# Altium schematic sheet P0_Main_Connect.SchDoc
size A2
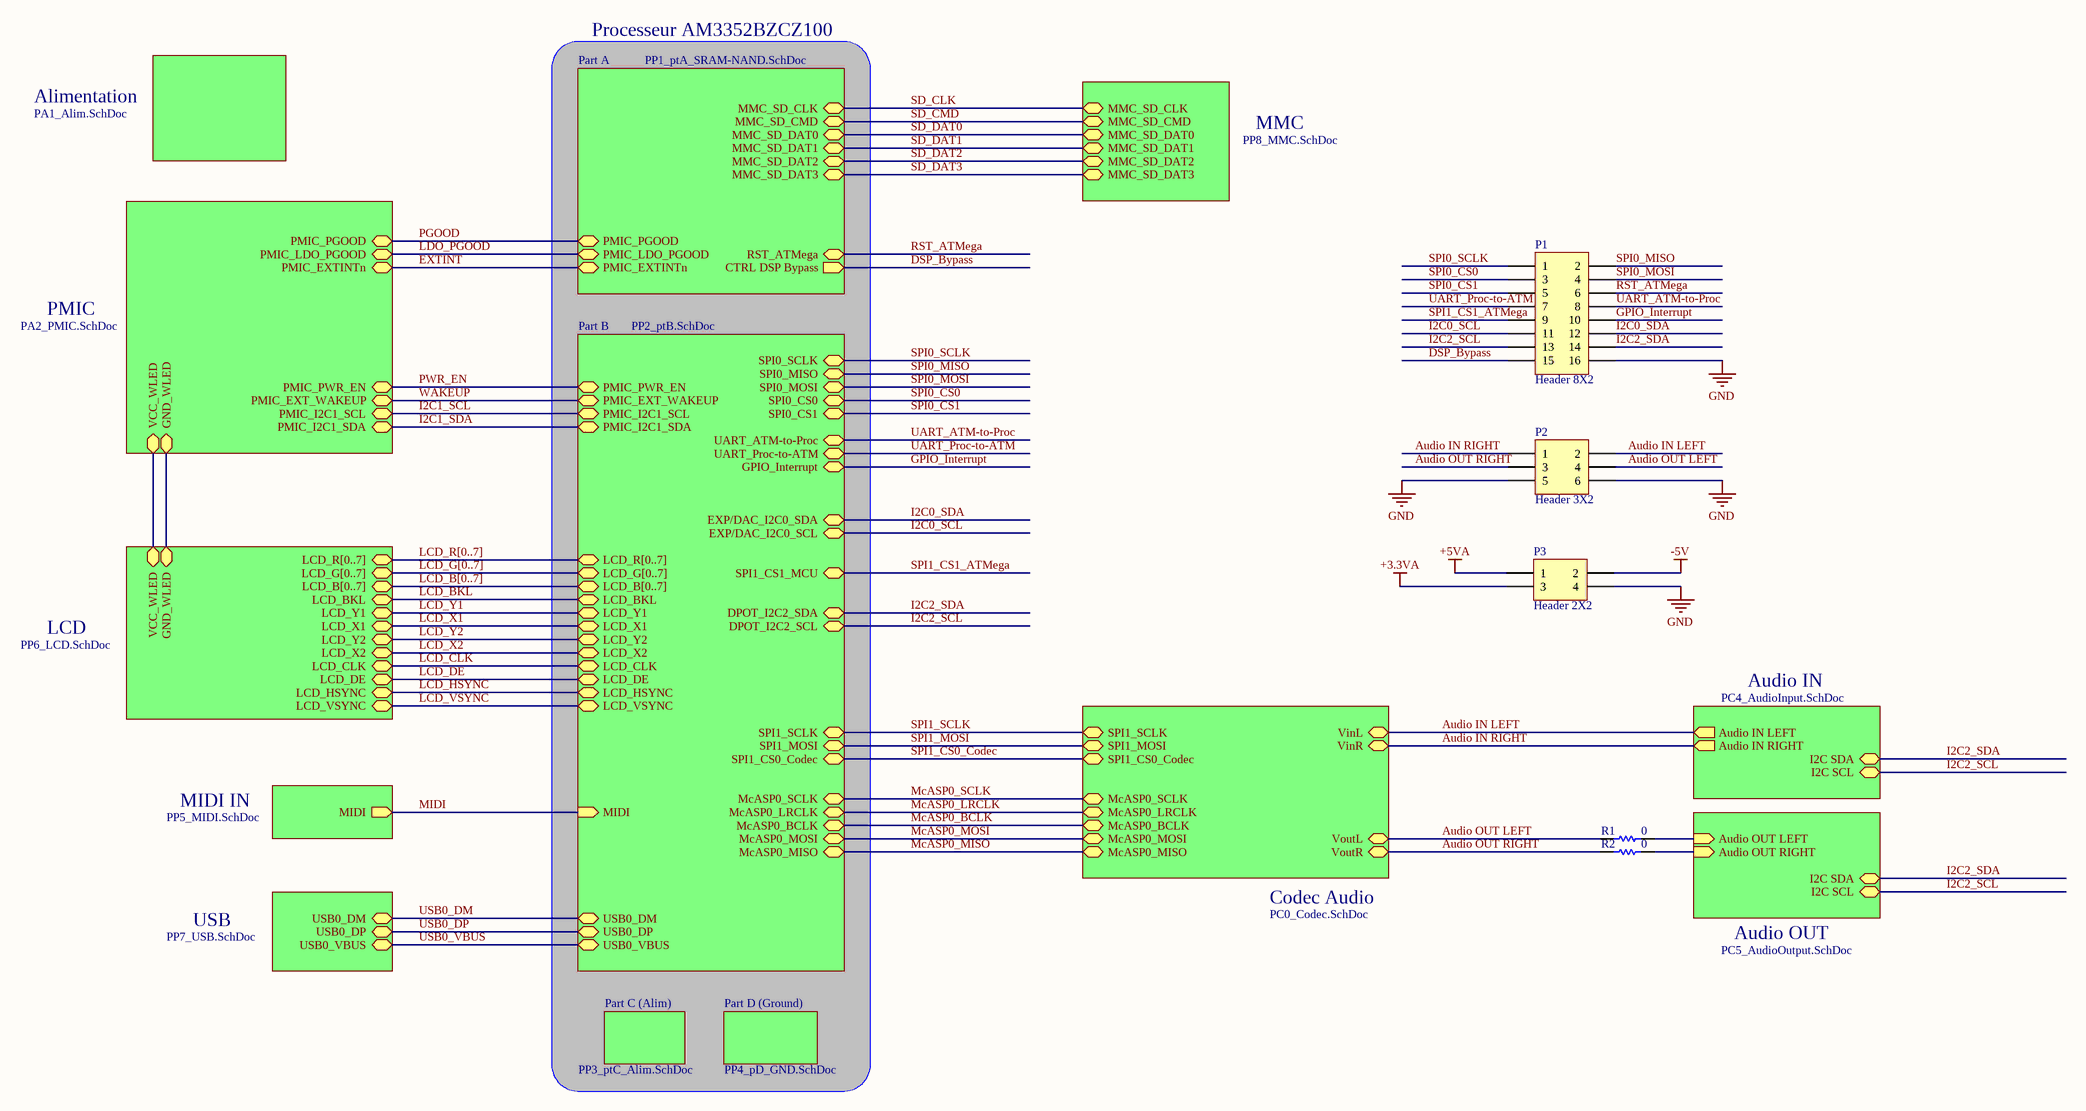
[diagram p0: P0_Main_Connect.SchDoc]

## Parts
P1  Header 8X2  [CONN_1241050-8_T]
P2  Header 3X2  [CONN_1241050-3_T]
P3  Header 2X2  [CONN_1241050-2_T]
R1  value 0  [RESC1608X05]  (hidden comment: Res 0 Ohm)
R2  value 0  [RESC1608X05]  (hidden comment: Res 0 Ohm)

## Sub-sheets
Alimentation = PA1_Alim.SchDoc: no entries
Audio IN = PC4_AudioInput.SchDoc: Audio IN RIGHT (out), Audio IN LEFT (out), I2C SCL, I2C SDA
Audio OUT = PC5_AudioOutput.SchDoc: Audio OUT RIGHT (in), Audio OUT LEFT (in), I2C SCL, I2C SDA
Codec Audio = PC0_Codec.SchDoc: SPI1_SCLK, SPI1_CS0_Codec, SPI1_MOSI, McASP0_LRCLK, McASP0_BCLK, McASP0_MOSI, McASP0_MISO, McASP0_SCLK, VoutL, VoutR, VinL, VinR
LCD = PP6_LCD.SchDoc: LCD_R[0..7], LCD_G[0..7], LCD_B[0..7], LCD_BKL, LCD_Y1, LCD_X1, LCD_Y2, LCD_X2, LCD_CLK, LCD_DE, LCD_HSYNC, LCD_VSYNC, GND_WLED, VCC_WLED
MIDI IN = PP5_MIDI.SchDoc: MIDI (out)
MMC = PP8_MMC.SchDoc: MMC_SD_CMD, MMC_SD_DAT0, MMC_SD_DAT1, MMC_SD_DAT2, MMC_SD_DAT3, MMC_SD_CLK
Part A = PP1_ptA_SRAM-NAND.SchDoc: CTRL DSP Bypass (out), RST_ATMega, MMC_SD_CLK, MMC_SD_CMD, MMC_SD_DAT0, MMC_SD_DAT1, MMC_SD_DAT2, MMC_SD_DAT3, PMIC_PGOOD, PMIC_LDO_PGOOD, PMIC_EXTINTn
Part B = PP2_ptB.SchDoc: MIDI (in), USB0_DM, USB0_DP, USB0_VBUS, SPI1_SCLK, SPI1_MOSI, SPI1_CS0_Codec, UART_ATM-to-Proc, UART_Proc-to-ATM, GPIO_Interrupt, SPI0_SCLK, SPI0_MISO, SPI0_MOSI, SPI0_CS0, SPI0_CS1, LCD_R[0..7], LCD_G[0..7], LCD_B[0..7], LCD_BKL, LCD_Y1, LCD_X1, LCD_Y2, LCD_X2, LCD_CLK, LCD_DE, LCD_HSYNC, LCD_VSYNC, PMIC_EXT_WAKEUP, PMIC_PWR_EN, PMIC_I2C1_SCL, PMIC_I2C1_SDA, SPI1_CS1_MCU, EXP/DAC_I2C0_SCL, EXP/DAC_I2C0_SDA, DPOT_I2C2_SDA, DPOT_I2C2_SCL, McASP0_LRCLK, McASP0_BCLK, McASP0_MOSI, McASP0_MISO, McASP0_SCLK
Part C (Alim) = PP3_ptC_Alim.SchDoc: no entries
Part D (Ground) = PP4_pD_GND.SchDoc: no entries
PMIC = PA2_PMIC.SchDoc: PMIC_EXT_WAKEUP, PMIC_PWR_EN, PMIC_I2C1_SCL, PMIC_I2C1_SDA, VCC_WLED, GND_WLED, PMIC_PGOOD, PMIC_LDO_PGOOD, PMIC_EXTINTn
USB = PP7_USB.SchDoc: USB0_VBUS, USB0_DP, USB0_DM

## Nets
+3.3VA: P3.3
+5VA: P3.1
-5V: P3.2
GND: P1.16 P2.5 P2.6 P3.4
Audio IN LEFT: P2.2 ; sheet Audio IN/Audio IN LEFT, sheet Codec Audio/VinL
Audio IN RIGHT: P2.1 ; sheet Audio IN/Audio IN RIGHT, sheet Codec Audio/VinR
Audio OUT LEFT: P2.4 R1.1 ; sheet Codec Audio/VoutL
Audio OUT RIGHT: P2.3 R2.1 ; sheet Codec Audio/VoutR
DSP_Bypass: P1.15 ; sheet Part A/CTRL DSP Bypass
EXTINT: sheet Part A/PMIC_EXTINTn, sheet PMIC/PMIC_EXTINTn
GPIO_Interrupt: P1.10 ; sheet Part B/GPIO_Interrupt
I2C0_SCL: P1.11 ; sheet Part B/EXP/DAC_I2C0_SCL
I2C0_SDA: P1.12 ; sheet Part B/EXP/DAC_I2C0_SDA
I2C1_SCL: sheet Part B/PMIC_I2C1_SCL, sheet PMIC/PMIC_I2C1_SCL
I2C1_SDA: sheet Part B/PMIC_I2C1_SDA, sheet PMIC/PMIC_I2C1_SDA
I2C2_SCL: P1.13 ; sheet Part B/DPOT_I2C2_SCL, sheet Audio IN/I2C SCL, sheet Audio OUT/I2C SCL
I2C2_SDA: P1.14 ; sheet Part B/DPOT_I2C2_SDA, sheet Audio IN/I2C SDA, sheet Audio OUT/I2C SDA
LCD_BKL: sheet Part B/LCD_BKL, sheet LCD/LCD_BKL
LCD_CLK: sheet Part B/LCD_CLK, sheet LCD/LCD_CLK
LCD_DE: sheet Part B/LCD_DE, sheet LCD/LCD_DE
LCD_HSYNC: sheet Part B/LCD_HSYNC, sheet LCD/LCD_HSYNC
LCD_VSYNC: sheet Part B/LCD_VSYNC, sheet LCD/LCD_VSYNC
LCD_X1: sheet Part B/LCD_X1, sheet LCD/LCD_X1
LCD_X2: sheet Part B/LCD_X2, sheet LCD/LCD_X2
LCD_Y1: sheet Part B/LCD_Y1, sheet LCD/LCD_Y1
LCD_Y2: sheet Part B/LCD_Y2, sheet LCD/LCD_Y2
LDO_PGOOD: sheet Part A/PMIC_LDO_PGOOD, sheet PMIC/PMIC_LDO_PGOOD
McASP0_BCLK: sheet Part B/McASP0_BCLK, sheet Codec Audio/McASP0_BCLK
McASP0_LRCLK: sheet Part B/McASP0_LRCLK, sheet Codec Audio/McASP0_LRCLK
McASP0_MISO: sheet Part B/McASP0_MISO, sheet Codec Audio/McASP0_MISO
McASP0_MOSI: sheet Part B/McASP0_MOSI, sheet Codec Audio/McASP0_MOSI
McASP0_SCLK: sheet Part B/McASP0_SCLK, sheet Codec Audio/McASP0_SCLK
MIDI: sheet Part B/MIDI, sheet MIDI IN/MIDI
PGOOD: sheet Part A/PMIC_PGOOD, sheet PMIC/PMIC_PGOOD
PWR_EN: sheet Part B/PMIC_PWR_EN, sheet PMIC/PMIC_PWR_EN
RST_ATMega: P1.6 ; sheet Part A/RST_ATMega
SD_CLK: sheet Part A/MMC_SD_CLK, sheet MMC/MMC_SD_CLK
SD_CMD: sheet Part A/MMC_SD_CMD, sheet MMC/MMC_SD_CMD
SD_DAT0: sheet Part A/MMC_SD_DAT0, sheet MMC/MMC_SD_DAT0
SD_DAT1: sheet Part A/MMC_SD_DAT1, sheet MMC/MMC_SD_DAT1
SD_DAT2: sheet Part A/MMC_SD_DAT2, sheet MMC/MMC_SD_DAT2
SD_DAT3: sheet Part A/MMC_SD_DAT3, sheet MMC/MMC_SD_DAT3
SPI0_CS0: P1.3 ; sheet Part B/SPI0_CS0
SPI0_CS1: P1.5 ; sheet Part B/SPI0_CS1
SPI0_MISO: P1.2 ; sheet Part B/SPI0_MISO
SPI0_MOSI: P1.4 ; sheet Part B/SPI0_MOSI
SPI0_SCLK: P1.1 ; sheet Part B/SPI0_SCLK
SPI1_CS0_Codec: sheet Part B/SPI1_CS0_Codec, sheet Codec Audio/SPI1_CS0_Codec
SPI1_CS1_ATMega: P1.9 ; sheet Part B/SPI1_CS1_MCU
SPI1_MOSI: sheet Part B/SPI1_MOSI, sheet Codec Audio/SPI1_MOSI
SPI1_SCLK: sheet Part B/SPI1_SCLK, sheet Codec Audio/SPI1_SCLK
UART_ATM-to-Proc: P1.8 ; sheet Part B/UART_ATM-to-Proc
UART_Proc-to-ATM: P1.7 ; sheet Part B/UART_Proc-to-ATM
USB0_DM: sheet Part B/USB0_DM, sheet USB/USB0_DM
USB0_DP: sheet Part B/USB0_DP, sheet USB/USB0_DP
USB0_VBUS: sheet Part B/USB0_VBUS, sheet USB/USB0_VBUS
WAKEUP: sheet Part B/PMIC_EXT_WAKEUP, sheet PMIC/PMIC_EXT_WAKEUP
NetR1_2: R1.2 ; sheet Audio OUT/Audio OUT LEFT
NetR2_2: R2.2 ; sheet Audio OUT/Audio OUT RIGHT
(unnamed): sheet PMIC/VCC_WLED, sheet LCD/VCC_WLED
(unnamed): sheet PMIC/GND_WLED, sheet LCD/GND_WLED

## Buses and harness runs
bus LCD_B[0..7] = sheet LCD/LCD_B[0..7] = sheet Part B/LCD_B[0..7]
bus LCD_G[0..7] = sheet LCD/LCD_G[0..7] = sheet Part B/LCD_G[0..7]
bus LCD_R[0..7] = sheet LCD/LCD_R[0..7] = sheet Part B/LCD_R[0..7]

## Notes on the sheet
- Processeur AM3352BZCZ100

## Library data of the parts
P1 = Header 8X2: Header, 8-Pin, Dual row; Fabricant: SAMTEC; Fournisseur: Farnell; RefFabricant: TSM-108-02-T-DV; RefFournisseur: 2856657; DataSheet: http://www.farnell.com/datasheets/318453.pdf
P2 = Header 3X2: Header, 3-Pin, Dual row; Fabricant: SAMTEC; Fournisseur: Farnell; RefFabricant: TSM-103-01-T-DV; RefFournisseur: 2505049; DataSheet: http://www.farnell.com/datasheets/318453.pdf
P3 = Header 2X2: Header, 2-Pin, Dual row; Fabricant: AMP - TE CONNECTIVITY; Fournisseur: Farnell; RefFabricant: 1241050-2; RefFournisseur: 9689559; DataSheet: http://www.farnell.com/datasheets/318453.pdf
R1 R2 = Res1: Resistor; Fabricant: VISHAY; Fournisseur: Farnell; RefFabricant: CRCW06030000Z0EB; RefFournisseur: 2616741; Case: 0603 [1608 Metric]